# Altium schematic sheet Sheet2.SchDoc
size A4; SheetNumber: 1; SheetTotal: 1
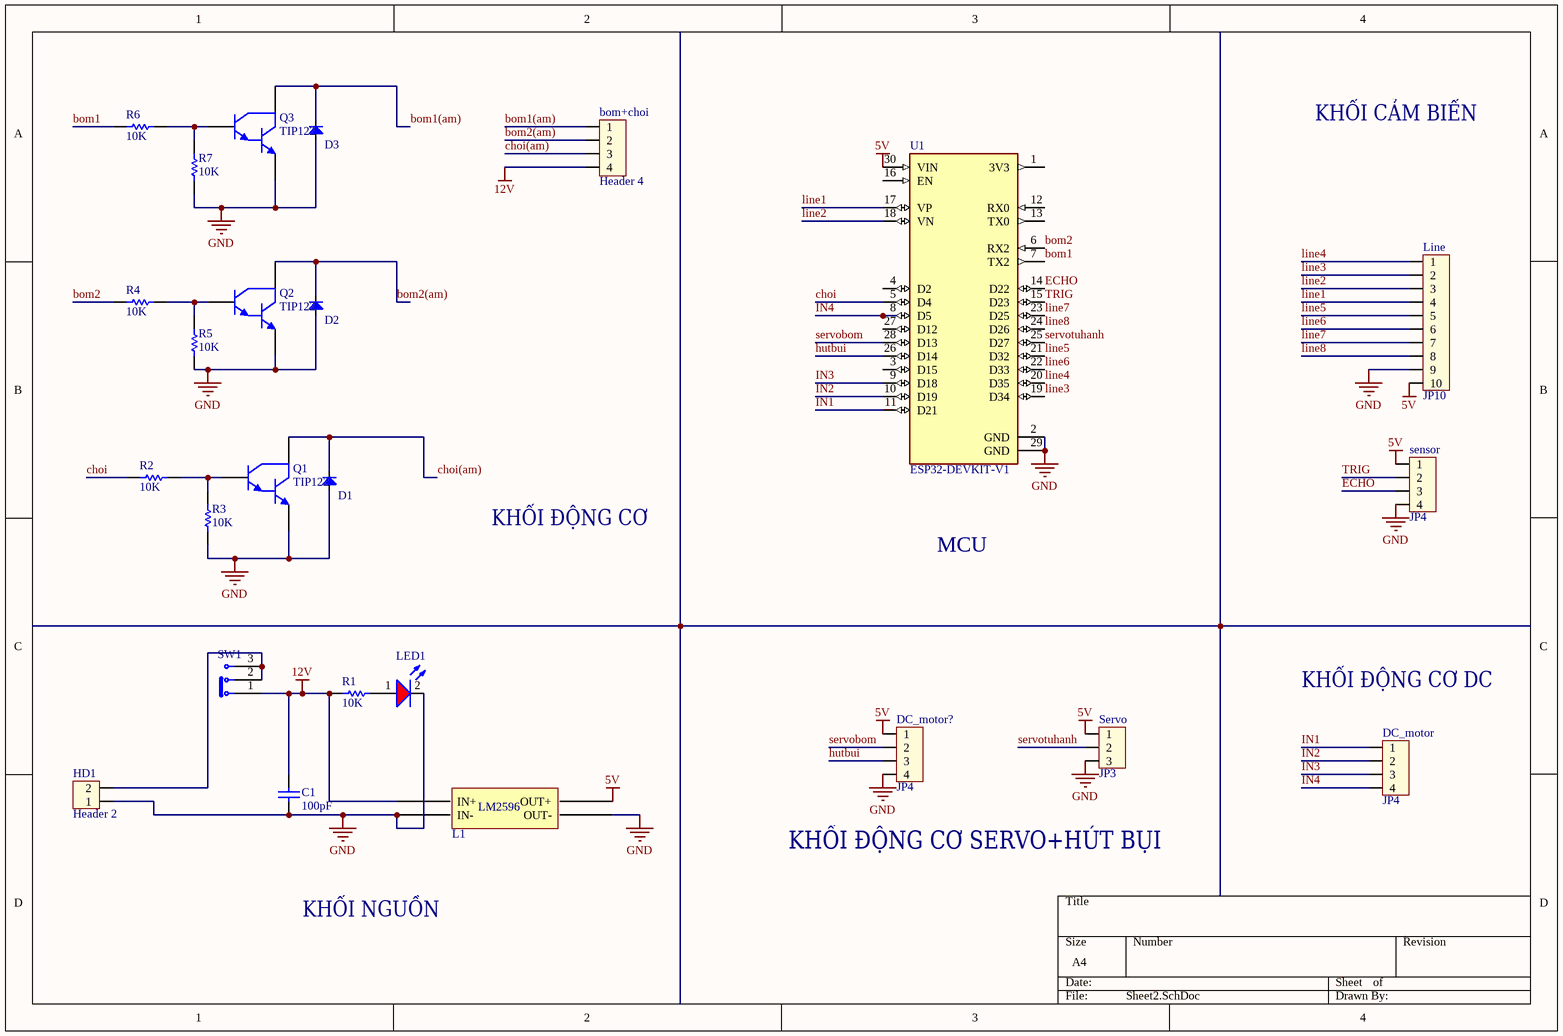
[diagram p0: Sheet2.SchDoc]

## Parts
bom+choi  Header 4  [HED4]
C1  value 100pF  [CN1.5]  (hidden comment: Cap Non-Pol)
D1  Diode  [DIO-1A]  (value not drawn)
D2  Diode  [DIO-1A]  (value not drawn)
D3  Diode  [DIO-1A]  (value not drawn)
DC_motor  JP4  [CON4]
DC_motor?  JP4  [CON4]
HD1  Header 2  [HED2]
L1  BUCK_LM2596  [BUCK_LM2596]  (value not drawn)
LED1  LED_R_3  [LED3R]  (value not drawn)
Line  JP10  [CON10]
Q1  TIP122  [QTO-220]
Q2  TIP122  [QTO-220]
Q3  TIP122  [QTO-220]
R1  value 10K  [R1/4W]  (hidden comment: Res1)
R2  value 10K  [R1/4W]  (hidden comment: Res1)
R3  value 10K  [R1/4W]  (hidden comment: Res1)
R4  value 10K  [R1/4W]  (hidden comment: Res1)
R5  value 10K  [R1/4W]  (hidden comment: Res1)
R6  value 10K  [R1/4W]  (hidden comment: Res1)
R7  value 10K  [R1/4W]  (hidden comment: Res1)
sensor  JP4  [CON4]
Servo  JP3  [CON3]
SW1  1825159-1  [SW_1825159-1]  (value not drawn)
U1  ESP32-DEVKIT-V1  [MODULE_ESP32_DEVKIT_V1]

## Nets
5V: DC_motor?.1 L1.4(OUT+) Line.10 sensor.1 Servo.1 U1.30(VIN)
12V: bom+choi.4 C1.2 L1.1(IN+) R1.2 SW1.1
GND: C1.1 D1.1(A) D2.1(A) D3.1(A) DC_motor?.4 HD1.1 L1.2(IN-) L1.3(OUT-) LED1.2(K) Line.9 Q1.3(E) Q2.3(E) Q3.3(E) R3.2 R5.2 R7.2 sensor.4 Servo.3 U1.2(GND) U1.29(GND)
bom1: R6.1 U1.7(TX2)
bom1(am): bom+choi.1 D3.2(K) Q3.2(C)
bom2: R4.1 U1.6(RX2)
bom2(am): bom+choi.2 D2.2(K) Q2.2(C)
choi: R2.1 U1.5(D4)
choi(am): bom+choi.3 D1.2(K) Q1.2(C)
ECHO: sensor.3 U1.14(D22)
hutbui: DC_motor?.3 U1.26(D14)
IN1: DC_motor.1 U1.11(D21)
IN2: DC_motor.2 U1.10(D19)
IN3: DC_motor.3 U1.9(D18)
IN4: DC_motor.4 U1.8(D5)
line1: Line.4 U1.17(VP)
line2: Line.3 U1.18(VN)
line3: Line.2 U1.19(D34)
line4: Line.1 U1.20(D35)
line5: Line.5 U1.21(D32)
line6: Line.6 U1.22(D33)
line7: Line.7 U1.23(D25)
line8: Line.8 U1.24(D26)
servobom: DC_motor?.2 U1.28(D13)
servotuhanh: Servo.2 U1.25(D27)
TRIG: sensor.2 U1.15(D23)
NetHD1_2: HD1.2 SW1.2 SW1.3
NetLED1_1: LED1.1(A) R1.1
NetQ1_1: Q1.1(B) R2.2 R3.1
NetQ2_1: Q2.1(B) R4.2 R5.1
NetQ3_1: Q3.1(B) R6.2 R7.1

Not connected (* = marked no-connect by the designer): U1 1(3V3) 3(D15) 4(D2) 12(RX0) 13(TX0) 16(EN) 27(D12)

## Notes on the sheet
- KHỐI CẢM BIẾN
- KHỐI ĐỘNG CƠ
- MCU
- KHỐI ĐỘNG CƠ DC
- KHỐI ĐỘNG CƠ SERVO+HÚT BỤI
- KHỐI NGUỒN
- (in symbol BUCK_LM2596) LM2596

## Library data of the parts
bom+choi = Hed4: Header 4 (Green); Value: Header 4
C1 = Cap Non-Pol: Capacitor
D1-D3 = Diode: Default Diode; Code - JEDEC: DO-214-AB; Value: 1N5007; Published: 8-Jun-2000; Revision: July-2002: Re-released for DXP Platform.; Publisher: Altium Limited
DC_motor DC_motor? sensor = Con4: Connector 4; Value: Connector 4
HD1 = Hed2: Header 2 (Green); Value: Header 2
LED1 = LED_RED_3MM: LED Red 3mm; ComponentLink1Description: Datasheet; ComponentLink1URL: D:\Dropbox\Datasheets\Opto and Illumination\LEDs\SMD LED.pdf; Unit Price: 0.0476; Value: Red
Line = Con10: Connector 10; Value: Connector 10
Q1-Q3 = TIP122: Darlington Silicon Power NPN Transistor, 8 Amp, 100 Volts and 65 Watts
R1-R7 = Res1_1: Resistor; Manufacturer: Generic Components; Class: Passive; Published: 08/06/2000; Publisher: Altium Hobart Technology Centre; SubClass: Resistor
Servo = Con3: Connector 3; Value: Connector 3
SW1 = 1825159-1: Slide Switch SPDT Through Hole; Contact_Current_Rating: .25 A; MF: TE Connectivity; Configuration_Pole-Throw: Single Pole - Double Throw; SnapEDA_Link: https://www.snapeda.com/parts/1825159-1/TE%20Connectivity%20ALCOSWITCH%20Switches/view-part/235580/?ref=snap; Switch_Type: Slide; Package: None; MP: 1825159-1; Price: None; EU_RoHS_Compliance: Compliant; Value: *; Availability: Unavailable; TE_purchase_URL: https://www.te.com/usa-en/product-1825159-1.html?te_bu=Cor&te_type=disp&te_campaign=seda_glo_cor-seda-global-disp-prtnr-fy19-seda-model-bom-cta_sma-317_1&elqCampaignId=32493
U1 = ESP32-DEVKIT-V1: Dual core, Wi-Fi: 2.4 GHz up to 150 Mbits/s,BLE (Bluetooth Low Energy) and legacy Bluetooth, 32 bits, Up to 240 MHz; Value: *; MP: ESP32-DEVKIT-V1; Availability: Unavailable; Package: None; Price: None